# EAGLE design Towtank_manual+direction (EAGLE 6.2)
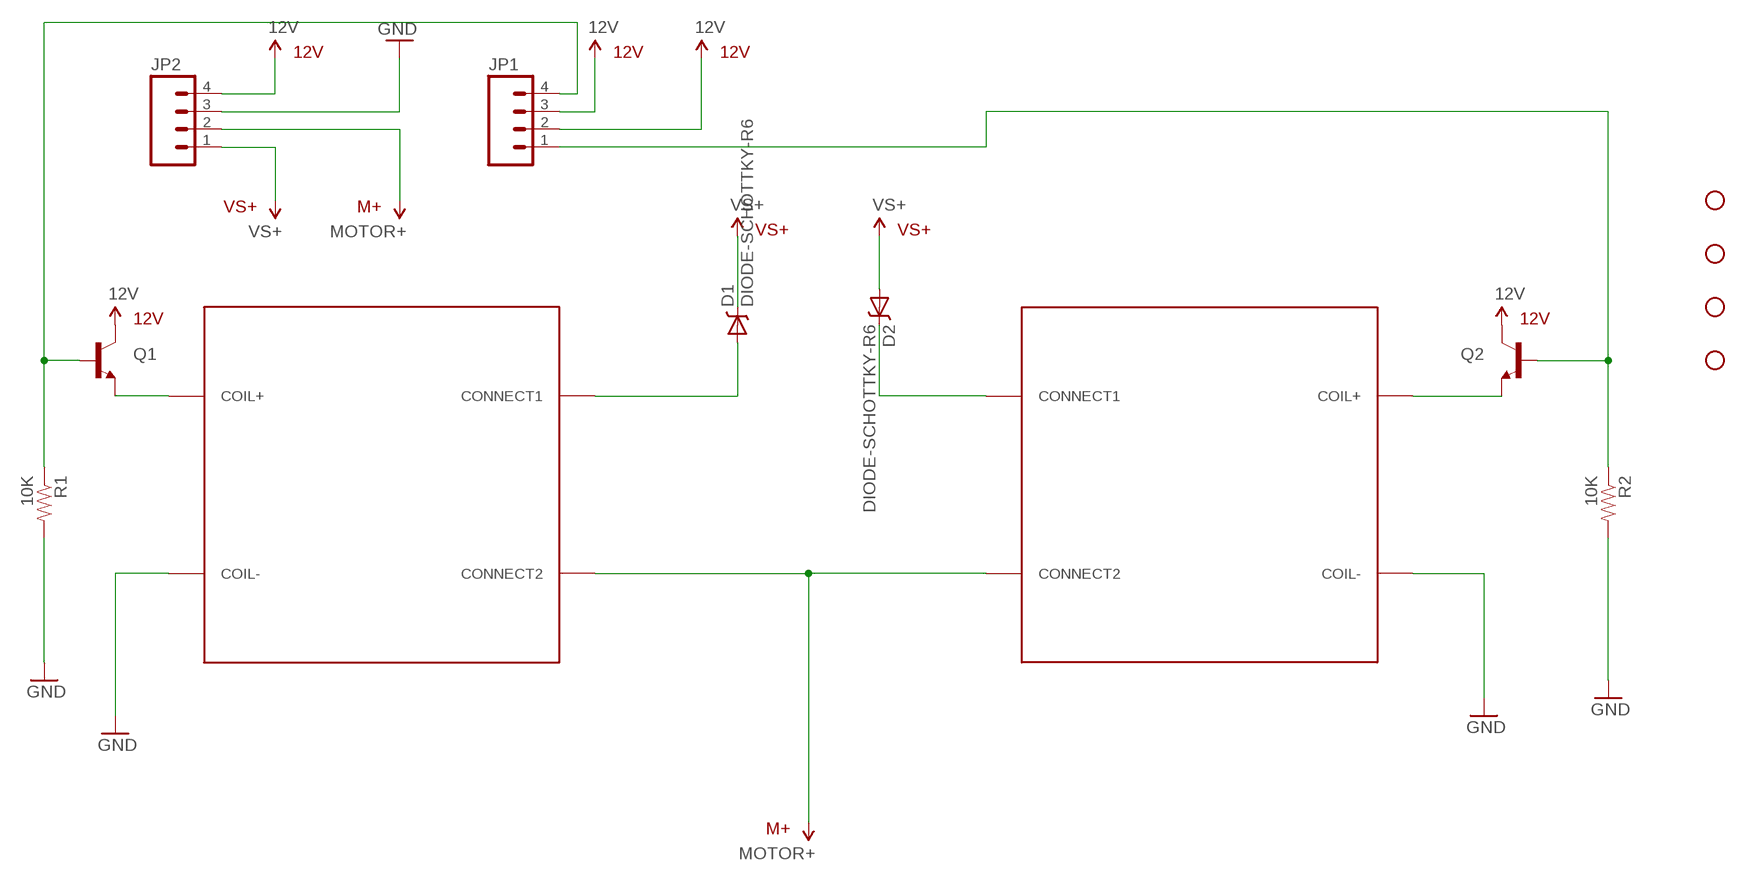
[diagram p0: schematic, sheet 1]

## Parts
D1  DIODE-SCHOTTKY-R6  [R6-AXIAL]
D2  DIODE-SCHOTTKY-R6  [R6-AXIAL]
JP1  M04LOCK_LONGPADS  [1X04_LOCK_LONGPADS]
JP2  M04SCREW_LOCK  [SCREWTERMINAL-3.5MM-4_LOCK]
JP3  STAND-OFF  [STAND-OFF]
JP4  STAND-OFF  [STAND-OFF]
JP5  STAND-OFF  [STAND-OFF]
JP6  STAND-OFF  [STAND-OFF]
Q1  TRANSISTOR_NPNTO-92-AMMO  [TO-92-AMMO]
Q2  TRANSISTOR_NPNTO-92-AMMO  [TO-92-AMMO]
R1  10K  RESISTORPTH-1/4W  [AXIAL-0.4]
R2  10K  RESISTORPTH-1/4W  [AXIAL-0.4]
U1  G5LE-1A4_SPST-NO  [PC-PIN]
U2  G5LE-1A4_SPST-NO  [PC-PIN]

## Nets
12V: JP1.2 JP1.3 JP2.4 Q1.3(C) Q2.3(C)
GND: JP2.3 R1.P$2 R2.P$2 U1.COIL- U2.COIL-
MOTOR+: JP2.2 U1.CONNECT2 U2.CONNECT2
N$1: D1.P$ANODE(ANODE) U1.CONNECT1
N$2: D2.P$CATHODE(CATHODE) U2.CONNECT1
N$3: JP1.4 Q1.2(B) R1.P$1
N$4: JP1.1 Q2.2(B) R2.P$1
N$5: Q1.1(E) U1.COIL+
N$6: Q2.1(E) U2.COIL+
VS+: D1.P$CATHODE(CATHODE) D2.P$ANODE(ANODE) JP2.1

## Library data of the parts
D1 D2 = JFD4_library_switches:DIODE-SCHOTTKY-R6
JP1 JP2 = SparkFun:M04: Header 4 Standard 4-pin 0.1" header. Use with straight break away headers (SKU : PRT-00116), right angle break away headers (PRT-00553), swiss pins (PRT-00743), machine pins (PRT-00117), and female headers (PRT-00115). Molex polarized connector foot print use with SKU : PRT-08231 with associated crimp pins and housings. 1MM SMD Version SKU: PRT-10208
JP3-JP6 = SparkFun:STAND-OFF: Stand Off This is the mechanical footprint for a #4 phillips button head screw. Use the keepout ring to avoid running the screw head into surrounding components. SKU : PRT-00447
Q1 Q2 = SparkFun:TRANSISTOR_NPN: Transistor NPN BJT configuration in SOT23 package. MMBT2222 is the common NPN we use. Double check BCE configuration again layout.
R1 R2 = SparkFun:RESISTOR: Resistor Basic schematic elements and footprints for 0603, 1206, and PTH resistors.
U1 U2 = JFD4_library_switches:G5LE-1A4_SPST-NO

## Board
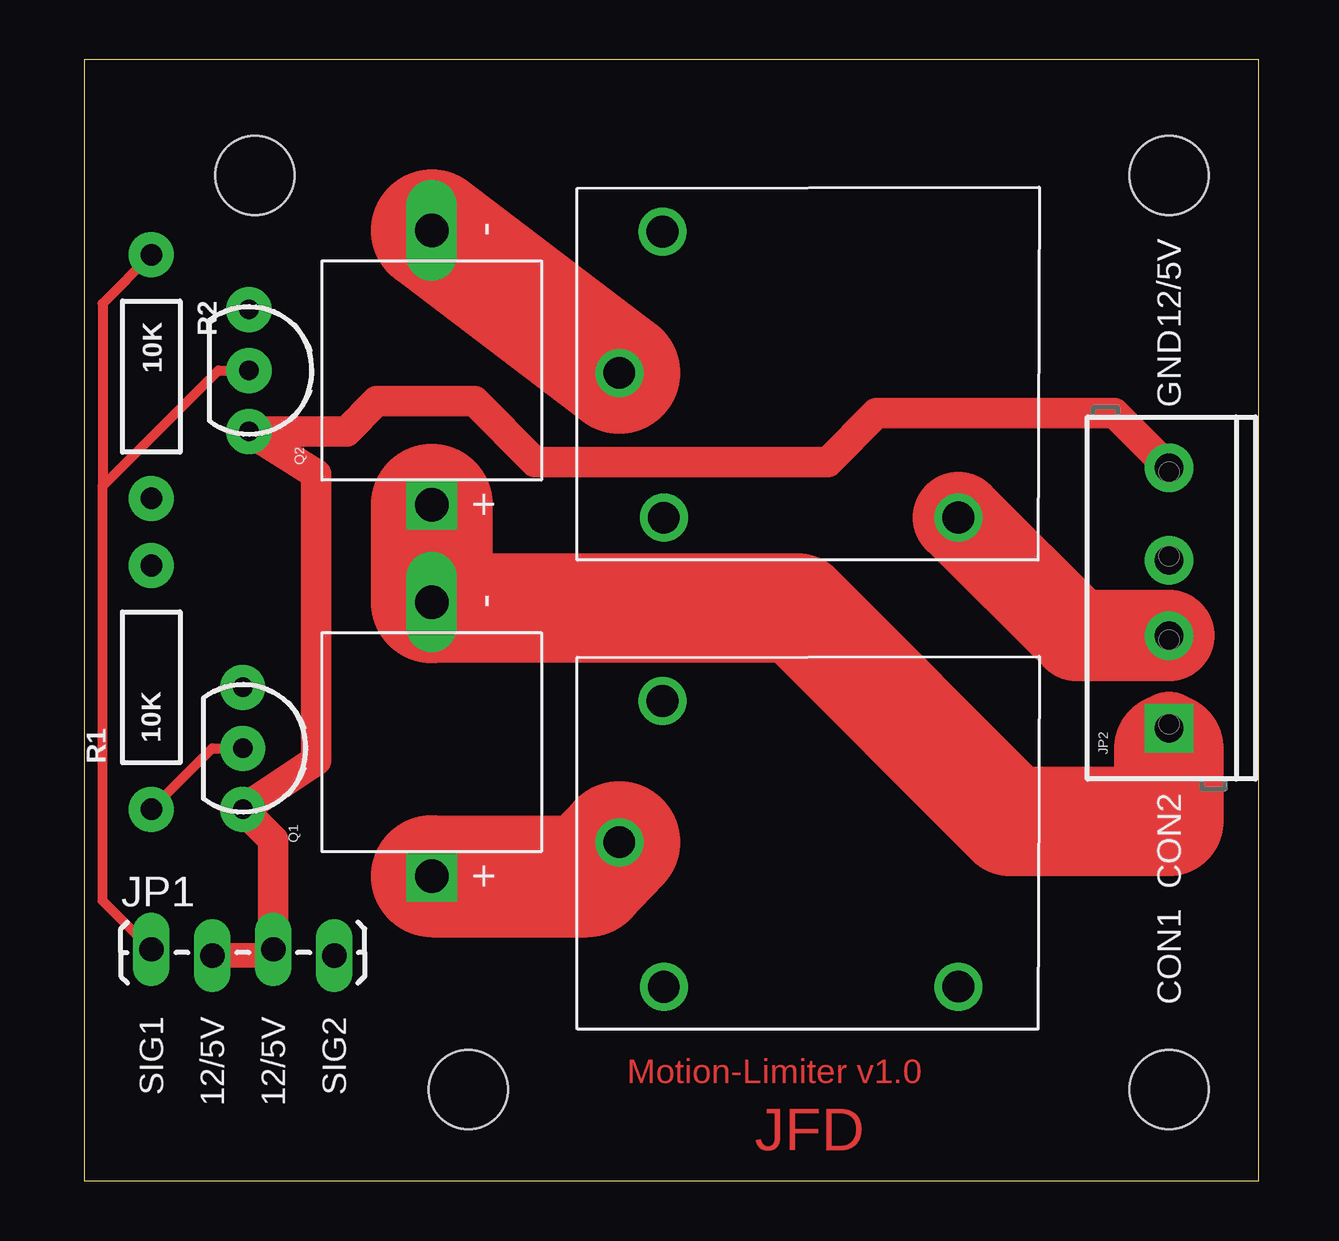
[diagram p1: board, top side]
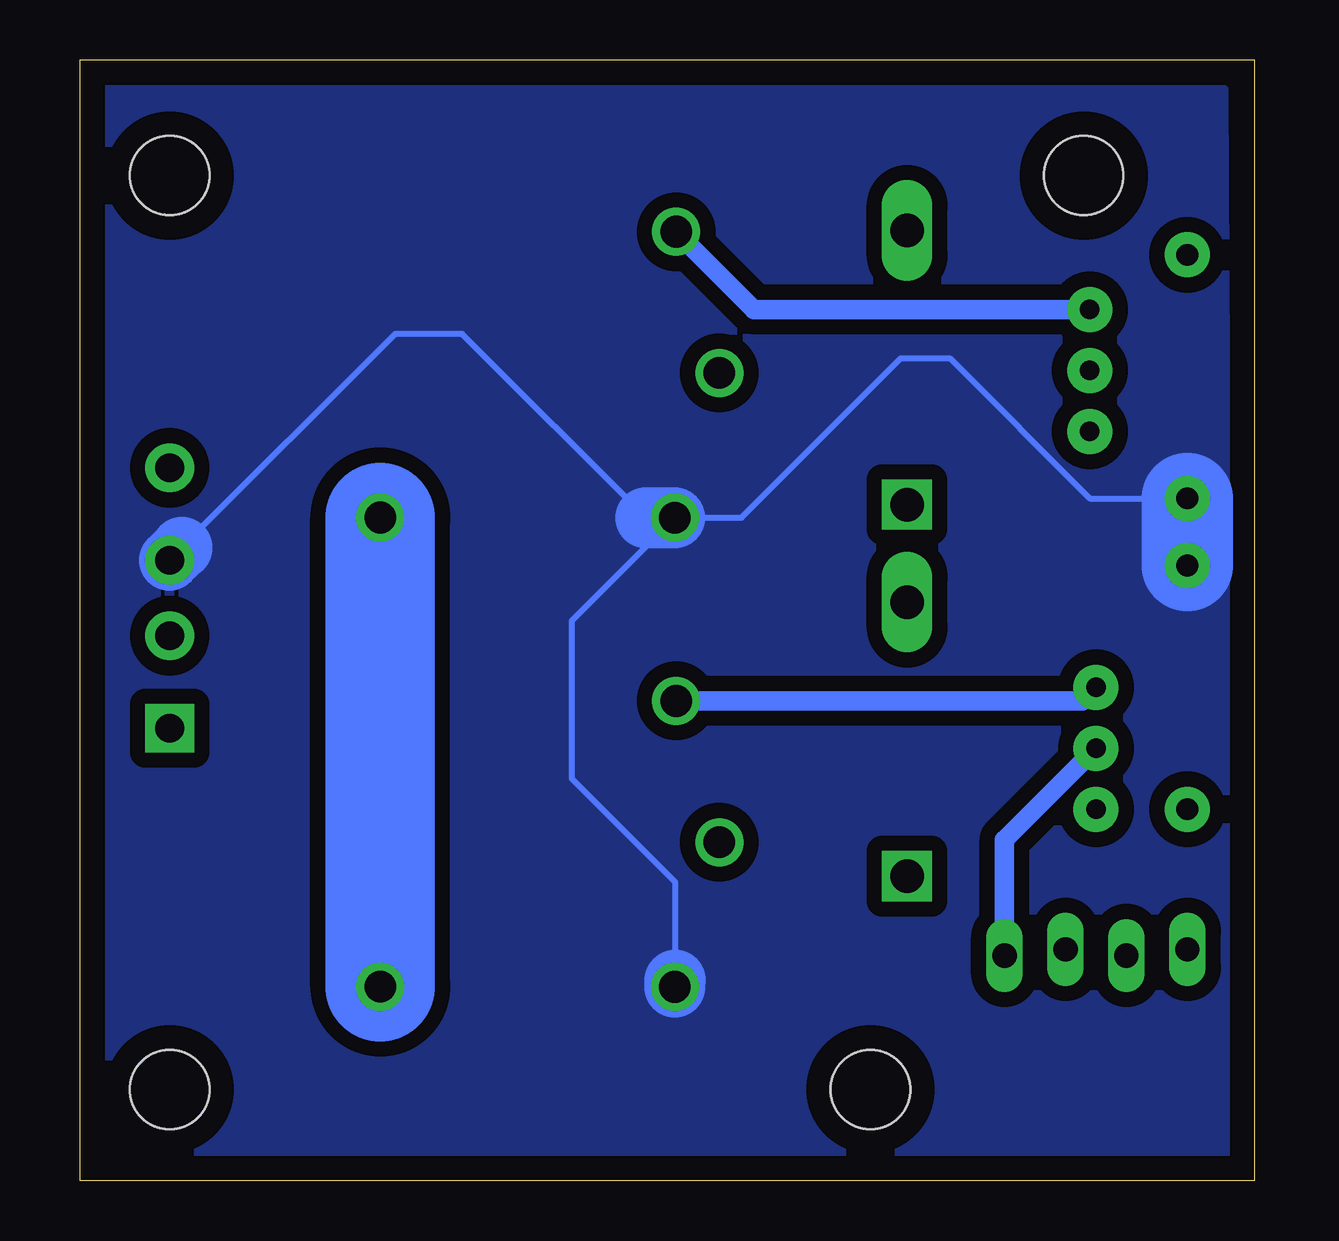
[diagram p2: board, bottom side, seen from below]

Size 48.95 x 46.73 mm. Coordinates in mm from the lower left corner, seen from the top.
Outline: 0,0 48.95,0 48.95,46.73 0,46.73 0,0
Copper layers (1*16): Top 0.035mm / dielectric 1.5mm / Bottom 0.035mm
Design rules: minimum track width 10mil, minimum drill 24mil, track to track 8mil, track to pad 8mil, pad to pad 8mil, via to via 8mil, smd to smd 8mil, copper to edge 40mil, drill to drill 8mil, minimum pad ring 10mil, minimum via ring 8mil, stop-mask expansion 4mil, vias tented up to drill 0mil, thermal gap 10mil

### Footprints (pad centres in the part's own frame; a part is rotated, then mirrored left to right if it is on the bottom)
R6-AXIAL = drill 1.397 square: P$ANODE -5.588,0 | drill 1.397 long: P$CATHODE 5.842,0
1X04_LOCK_LONGPADS = drill 1.016 long: 1 0,0; 2 2.54,-0.254; 3 5.08,0; 4 7.62,-0.254
SCREWTERMINAL-3.5MM-4_LOCK = drill 1.2 pad 2.032 square: 1 -0.178,0 | drill 1.2 pad 2.032: 2 3.678,0; 3 6.822,0; 4 10.678,0
STAND-OFF = hole 3.302: 0,0
TO-92-AMMO = drill 0.813 pad 1.88: 1 -2.54,0; 2 0,0; 3 2.54,0
AXIAL-0.4 = drill 0.9 pad 1.88: P$1 -5.08,0; P$2 5.08,0
PC-PIN = drill 1.32 pad 2: COIL+ 3.526,13.658; COIL- 3.58,1.74; CONNECT1 1.726,7.77; CONNECT2 15.86,1.748

### Placement (x,y rotation side)
D1  14.48,18.29 90 top
D2  14.48,33.78 90 top
JP1  2.79,9.65 0 top
JP2  45.21,19.05 90 top
JP3  45.21,3.81 0 top
JP4  45.21,41.91 0 top
JP5  16,3.81 0 top
JP6  7.11,41.91 0 top
Q1  6.6,18.03 270 top
Q2  6.86,33.78 270 top
R1  2.79,20.57 90 top
R2  2.79,33.53 270 top
U1  20.57,6.35 0 top
U2  20.57,25.91 0 top

### Tracks (layer width: path | path; a pad name or v marks a point on that pad's centre or on a via)
12V
  Top 0.254: 44.45,29.97 44.69,29.73 JP2.4
  Top 0.406: 7.87,9.4 JP1.3
  Top 1.016: JP1.2 7.87,9.4
  Top 1.27: JP1.3 7.87,14.22 Q1.3 9.65,17.53 9.65,29.46 Q2.3 10.92,31.24 12.19,32.51 16.26,32.51 18.8,29.97 30.99,29.97 33.02,32 42.94,32 JP2.4
GND
  Bottom 0.254: 25.36,27.65 33.02,35.31 35.81,35.31 44.7,26.42 | R2.P$2 6.86,28.45 12.7,34.29 14.73,34.29 21.37,27.65 U2.COIL- 28.45,23.35 28.45,16.76 24.13,12.45 24.13,8.38
  Bottom 2.54: 25.36,27.65 U2.COIL- | 44.7,26.42 44.7,26.38 JP2.3 | U1.COIL- 24.15,8.36 24.13,8.38
  Bottom 3.81: R2.P$2 R1.P$2
  pour Bottom (isolate 0.635): 1.27,45.47 48.01,45.47 47.75,0.76 1.02,0.76
MOTOR+
  Top 3.81: U2.CONNECT2 41.36,22.73 JP2.2
  Bottom 4.572: U1.CONNECT2 U2.CONNECT2
N$1
  Top 5.08: D1.P$ANODE 20.96,12.7 U1.CONNECT1
N$2
  Top 5.08: U2.CONNECT1 D2.P$CATHODE
N$3
  Top 0.406: R1.P$1 5.33,18.03 Q1.2
  Bottom 0.813: Q1.2 10.41,14.22 JP1.4
N$4
  Top 0.406: JP1.1 0.76,11.68 0.76,28.45 0.76,28.96 | 0.76,28.96 5.59,33.78 Q2.2 | R2.P$1 0.76,36.58 0.76,28.96
N$5
  Bottom 0.813: Q1.1 7.17,20.01 U1.COIL+
N$6
  Bottom 0.813: Q2.1 20.86,36.32 U2.COIL+
VS+
  Top 3.048: JP2.1 45.21,18.03
  Top 4.572: 45.21,14.99 44.96,14.99 | 44.96,14.99 38.61,14.99 29.72,23.88 14.73,23.88 D1.P$CATHODE | 45.21,18.03 45.21,15.24 44.96,14.99
  Top 5.08: D2.P$ANODE D1.P$CATHODE

### Text on the board
Top: Motion-Limiter v1.0 | JFD
tPlace: 12/5V | GND | CON2 | CON1 | SIG1 | 12/5V | 12/5V | SIG2